# Altium schematic sheet zegar_st.SchDoc
size A4
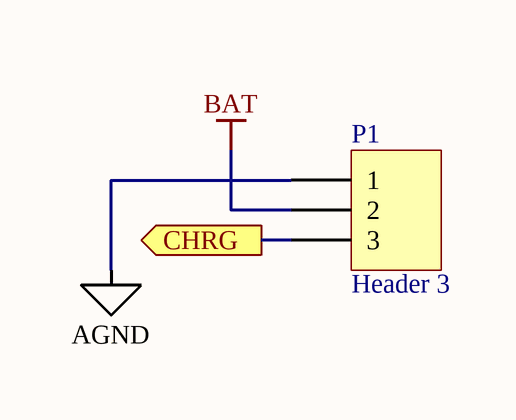
[diagram p0: zegar_st.SchDoc]

## Parts
P1  Header 3  [3SMD]

## Ports
CHRG

## Nets
AGND: P1.1
BAT: P1.2
CHRG: P1.3 ; port CHRG

## Library data of the parts
P1 = Header 3: Header, 3-Pin